# Altium schematic sheet Sheet1.SchDoc
size A3; DocumentNumber: 1; SheetNumber: 1; SheetTotal: 4
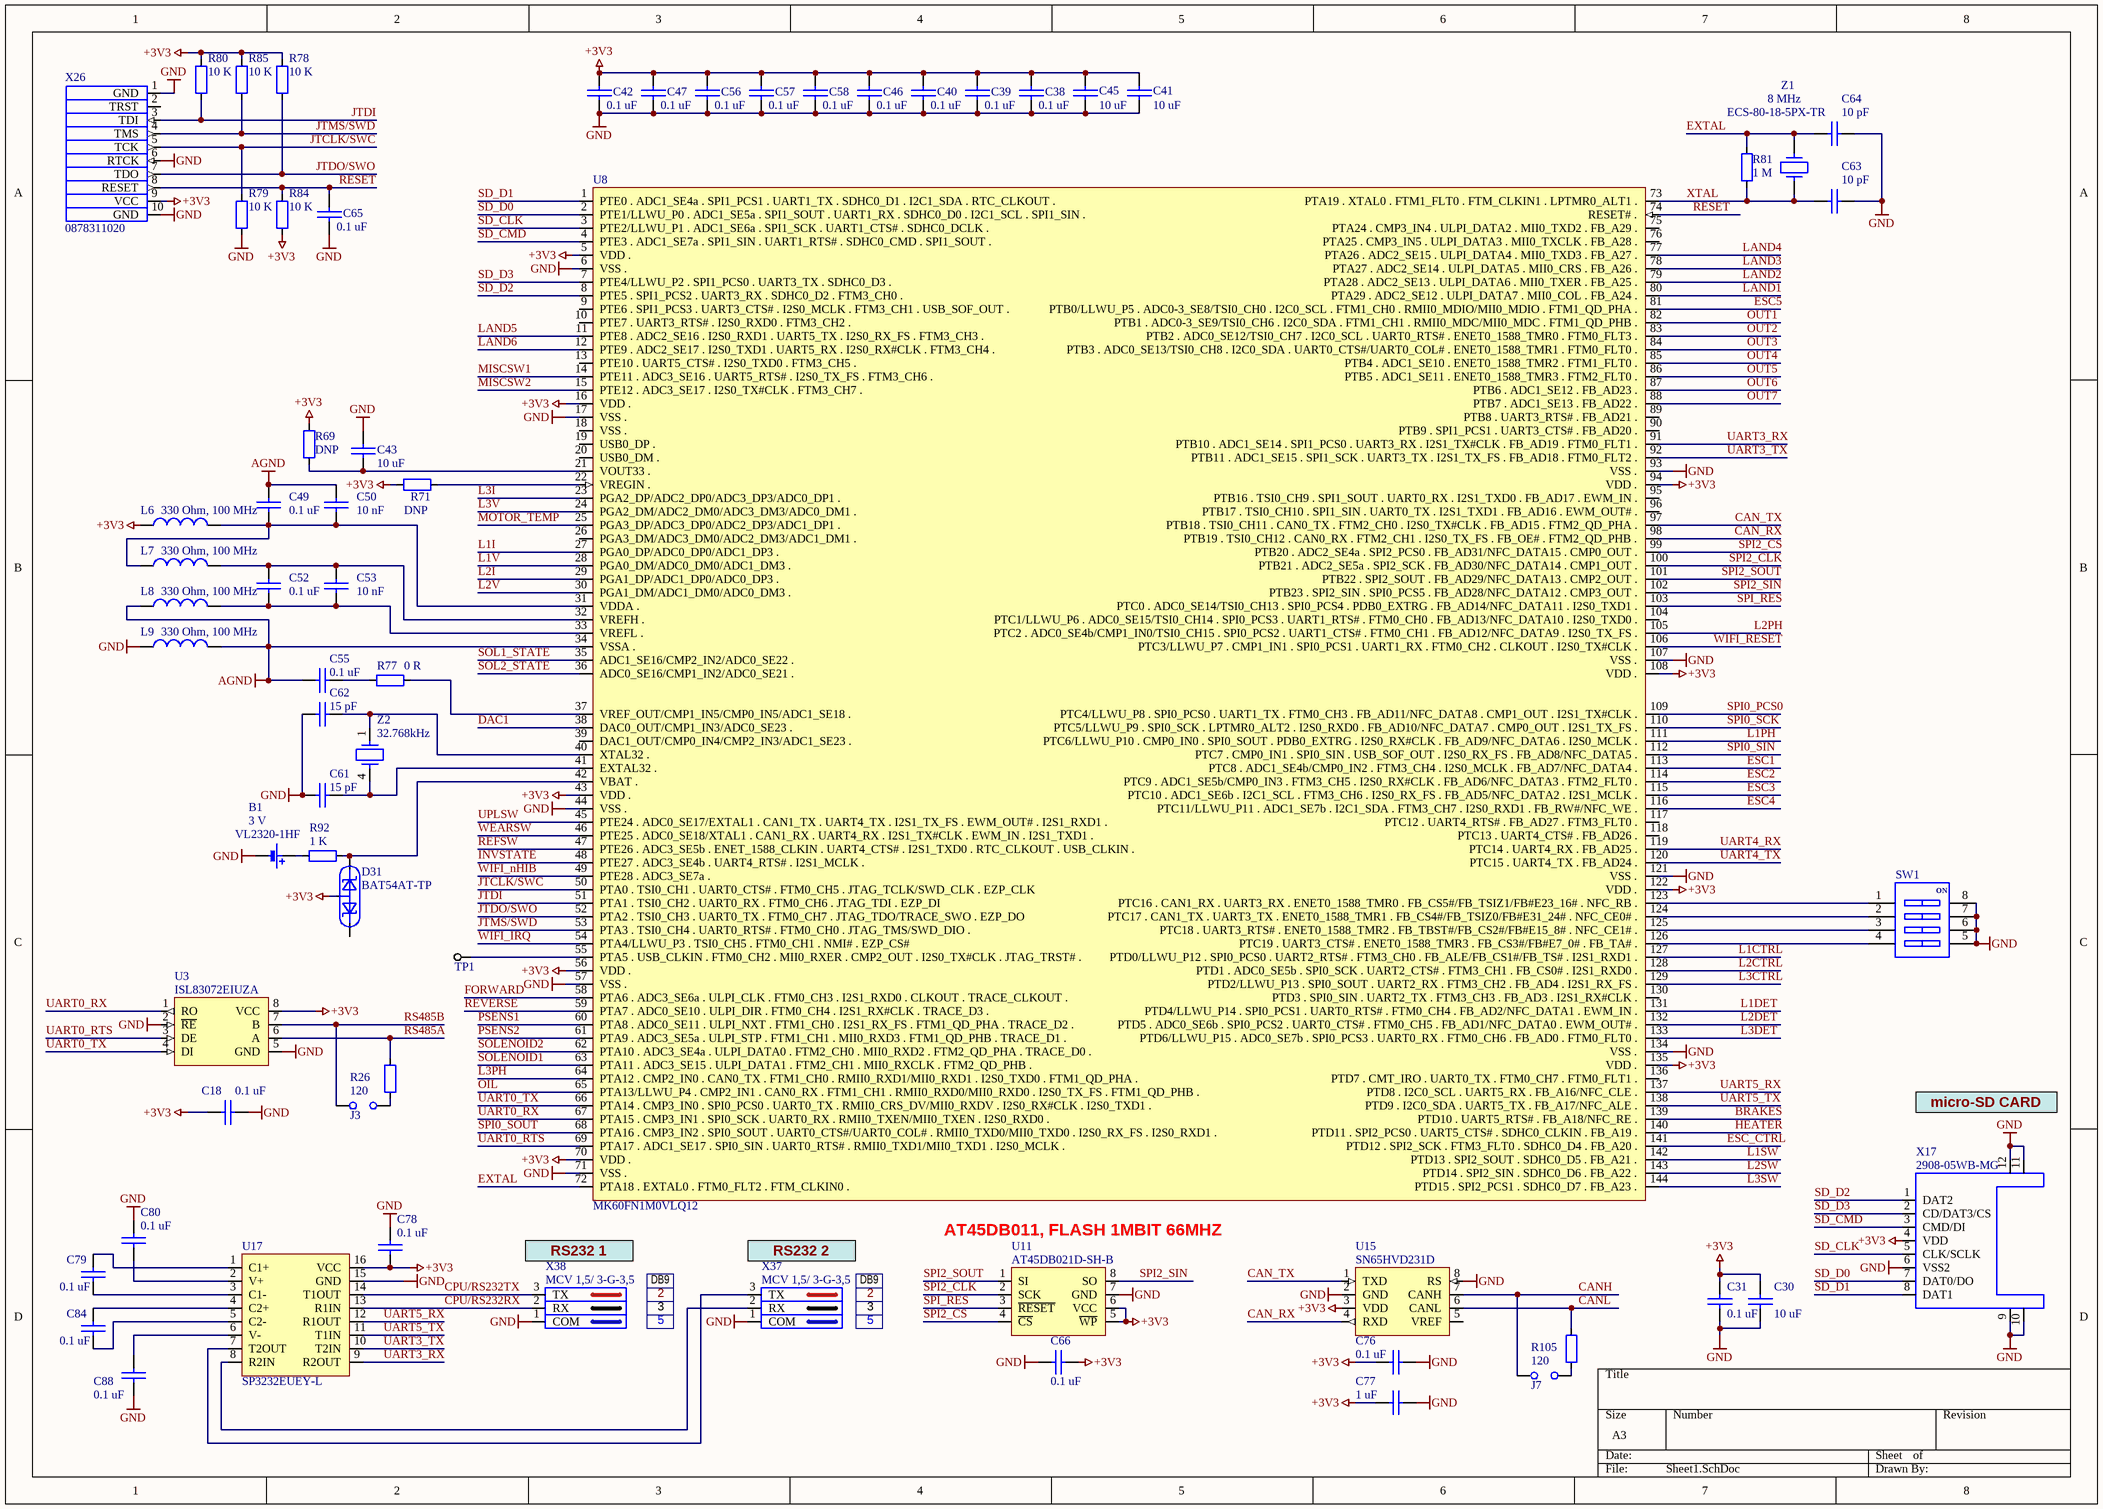
[diagram p0: Sheet1.SchDoc]

## Parts
B1  VL2320-1HF  value 3 V  [SANYO ML2430]
C18  value 0.1 uF  [1608[0603]]  (hidden comment: CVNF100K0603-25)
C30  value 10 uF  [2012[0805]]  (hidden comment: C2012X5R1C106K085AC)
C31  value 0.1 uF  [1608[0603]]  (hidden comment: CL10B104KA8NNND)
C38  value 0.1 uF  [1608[0603]]  (hidden comment: CL10B104KA8NNND)
C39  value 0.1 uF  [1608[0603]]  (hidden comment: CL10B104KA8NNND)
C40  value 0.1 uF  [1608[0603]]  (hidden comment: CL10B104KA8NNND)
C41  value 10 uF  [2012[0805]]  (hidden comment: C2012X5R1C106K085AC)
C42  value 0.1 uF  [1608[0603]]  (hidden comment: CL10B104KA8NNND)
C43  value 10 uF  [2012[0805]]  (hidden comment: C2012X5R1C106K085AC)
C45  value 10 uF  [2012[0805]]  (hidden comment: C2012X5R1C106K085AC)
C46  value 0.1 uF  [1608[0603]]  (hidden comment: CL10B104KA8NNND)
C47  value 0.1 uF  [1608[0603]]  (hidden comment: CL10B104KA8NNND)
C49  value 0.1 uF  [1608[0603]]  (hidden comment: CL10B104KA8NNND)
C50  value 10 nF  [1608[0603]]  (hidden comment: CL10B103JB8NNNC)
C52  value 0.1 uF  [1608[0603]]  (hidden comment: CL10B104KA8NNND)
C53  value 10 nF  [1608[0603]]  (hidden comment: CL10B103JB8NNNC)
C55  value 0.1 uF  [1608[0603]]  (hidden comment: CL10B104KA8NNND)
C56  value 0.1 uF  [1608[0603]]  (hidden comment: CL10B104KA8NNND)
C57  value 0.1 uF  [1608[0603]]  (hidden comment: CL10B104KA8NNND)
C58  value 0.1 uF  [1608[0603]]  (hidden comment: CL10B104KA8NNND)
C61  value 15 pF  [1608[0603]]  (hidden comment: CC0603JRNPO9BN150)
C62  value 15 pF  [1608[0603]]  (hidden comment: CC0603JRNPO9BN150)
C63  value 10 pF  [1608[0603]]  (hidden comment: CCPF010K0603)
C64  value 10 pF  [1608[0603]]  (hidden comment: CCPF010K0603)
C65  value 0.1 uF  [1608[0603]]  (hidden comment: CL10B104KA8NNND)
C66  value 0.1 uF  [1608[0603]]  (hidden comment: CL10B104KA8NNND)
C76  value 0.1 uF  [1608[0603]]  (hidden comment: CVNF100K0603-25)
C77  value 1 uF  [1608[0603]]  (hidden comment: GRM188R60J105KA01D)
C78  value 0.1 uF  [1608[0603]]  (hidden comment: CVNF100K0603-25)
C79  value 0.1 uF  [1608[0603]]  (hidden comment: CVNF100K0603-25)
C80  value 0.1 uF  [1608[0603]]  (hidden comment: CVNF100K0603-25)
C84  value 0.1 uF  [1608[0603]]  (hidden comment: CVNF100K0603-25)
C88  value 0.1 uF  [1608[0603]]  (hidden comment: CVNF100K0603-25)
D31  BAT54AT-TP  [SOT-523F]
J3  PH1-02-TA-HT  [HDR1X2V]  (value not drawn)
J7  PH1-02-TA-HT  [HDR1X2V]  (value not drawn)
L6  value 330 Ohm, 100 MHz  [0603]  (hidden comment: BLM18SG331TN1D)
L7  value 330 Ohm, 100 MHz  [0603]  (hidden comment: BLM18SG331TN1D)
L8  value 330 Ohm, 100 MHz  [0603]  (hidden comment: BLM18SG331TN1D)
L9  value 330 Ohm, 100 MHz  [0603]  (hidden comment: BLM18SG331TN1D)
R26  value 120  [0603]  (hidden comment: RL0603E120-1)
R69  value DNP  [0603]  (hidden comment: DNP_0603)  (no BOM)
R71  value DNP  [0603]  (hidden comment: DNP_0603)  (no BOM)
R77  value 0 R  [0603]  (hidden comment: RC0603JR-070RL)
R78  value 10 K  [0603]  (hidden comment: RL0603K010-1)
R79  value 10 K  [0603]  (hidden comment: RL0603K010-1)
R80  value 10 K  [0603]  (hidden comment: RL0603K010-1)
R81  value 1 M  [0603]  (hidden comment: RC0603FR-071ML)
R84  value 10 K  [0603]  (hidden comment: RL0603K010-1)
R85  value 10 K  [0603]  (hidden comment: RL0603K010-1)
R92  value 1 K  [0603]  (hidden comment: RC0603FR-071KL)
R105  value 120  [0603]  (hidden comment: RL0603E120-1)
SW1  MCDHN-04F-T-V  [MCDHN-04F-T-V]  (value not drawn)
TP1  Test_point 0.7 мм  [Test point 0.7 мм]  (value not drawn)  (net tie, no BOM)
U3  ISL83072EIUZA  [MSOP 8]
U8  MK60FN1M0VLQ12  [LQFP144]
U11  AT45DB021D-SH-B  [SO-8  wide]
U15  SN65HVD231D  [SO-8]
U17  SP3232EUEY-L  [TSOP65P640-16AM]
X17  2908-05WB-MG  [2908-05WB-MG]
X26  0878311020  [878311020 MGRID WALL HDR SMD]
X37  MCV 1,5/ 3-G-3,5  [mcv1.5-3-g_3.5]
X38  MCV 1,5/ 3-G-3,5  [mcv1.5-3-g_3.5]
Z1  ECS-80-18-5PX-TR  value 8 MHz  [Quartz Crystal SMU4]
Z2  value 32.768kHz  [CM200S]  (hidden comment: CM200C32768DZBT)

## Nets
+3V3: C18.1 C30.1 C31.1 C38.2 C39.2 C40.2 C41.1 C42.2 C45.1 C46.2 C47.2 C56.2 C57.2 C58.2 C66.1 C76.1 C77.1 C78.1 D31.3 L6.1 R69.2 R71.1 R78.2 R80.2 R84.1 R85.2 U3.8(VCC) U8.5(VDD_.) U8.16(VDD_.) U8.43(VDD_.) U8.56(VDD_.) U8.70(VDD_.) U8.94(VDD_.) U8.108(VDD_.) U8.122(VDD_.) U8.135(VDD_.) U11.5(~{WP}) U11.6(VCC) U15.3(VDD) U17.16(VCC) X17.4(VDD) X26.9(VCC)
AGND: C49.2 C50.2 C55.2 L8.1 L9.2 U8.34(VSSA_.)
GND: B1.1 C18.2 C30.2 C31.2 C38.1 C39.1 C40.1 C41.2 C42.1 C43.2 C45.2 C46.1 C47.1 C56.1 C57.1 C58.1 C61.2 C62.2 C63.2 C64.2 C65.1 C66.2 C76.2 C77.2 C78.2 C80.1 C88.2 L9.1 R79.1 SW1.5 SW1.6 SW1.7 SW1.8 U3.2(~{RE}) U3.5(GND) U8.6(VSS_.) U8.17(VSS_.) U8.44(VSS_.) U8.57(VSS_.) U8.71(VSS_.) U8.93(VSS_.) U8.107(VSS_.) U8.121(VSS_.) U8.134(VSS_.) U11.7(GND) U15.2(GND) U15.8(RS) U17.15(GND) X17.6(VSS2) X17.9 X17.10(WP) X17.11(GND) X17.12(GND) X26.1(GND) X26.6(RTCK) X26.10(GND) X37.1(COM) X38.1(COM)
BRAKES: U8.139(PTD10_._UART5_RTS#_._FB_A18/NFC_RE_.)
CAN_RX: U8.98(PTB19_._TSI0_CH12_._CAN0_RX_._FTM2_CH1_._I2S0_TX_FS_._FB_OE#_._FTM2_QD_PHB_.) U15.4(RXD)
CAN_TX: U8.97(PTB18_._TSI0_CH11_._CAN0_TX_._FTM2_CH0_._I2S0_TX#CLK_._FB_AD15_._FTM2_QD_PHA_.) U15.1(TXD)
CANH: J7.1 U15.7(CANH)
CANL: R105.2 U15.6(CANL)
CPU/RS232RX: U17.13(R1IN) X38.2(RX)
CPU/RS232TX: U17.14(T1OUT) X38.3(TX)
DAC1: U8.38(DAC0_OUT/CMP1_IN3/ADC0_SE23_.)
ESC1: U8.113(PTC8_._ADC1_SE4b/CMP0_IN2_._FTM3_CH4_._I2S0_MCLK_._FB_AD7/NFC_DATA4_.)
ESC2: U8.114(PTC9_._ADC1_SE5b/CMP0_IN3_._FTM3_CH5_._I2S0_RX#CLK_._FB_AD6/NFC_DATA3_._FTM2_FLT0_.)
ESC3: U8.115(PTC10_._ADC1_SE6b_._I2C1_SCL_._FTM3_CH6_._I2S0_RX_FS_._FB_AD5/NFC_DATA2_._I2S1_MCLK_.)
ESC4: U8.116(PTC11/LLWU_P11_._ADC1_SE7b_._I2C1_SDA_._FTM3_CH7_._I2S0_RXD1_._FB_RW#/NFC_WE_.)
ESC5: U8.81(PTB0/LLWU_P5_._ADC0-3_SE8/TSI0_CH0_._I2C0_SCL_._FTM1_CH0_._RMII0_MDIO/MII0_MDIO_._FTM1_QD_PHA_.)
ESC_CTRL: U8.141(PTD12_._SPI2_SCK_._FTM3_FLT0_._SDHC0_D4_._FB_A20_.)
EXTAL: C64.1 R81.2 U8.72(PTA18_._EXTAL0_._FTM0_FLT2_._FTM_CLKIN0_.) Z1.2
FORWARD: U8.58(PTA6_._ADC3_SE6a_._ULPI_CLK_._FTM0_CH3_._I2S1_RXD0_._CLKOUT_._TRACE_CLKOUT_.)
HEATER: U8.140(PTD11_._SPI2_PCS0_._UART5_CTS#_._SDHC0_CLKIN_._FB_A19_.)
INVSTATE: U8.48(PTE27_._ADC3_SE4b_._UART4_RTS#_._I2S1_MCLK_.)
JTCLK/SWC: R79.2 U8.50(PTA0_._TSI0_CH1_._UART0_CTS#_._FTM0_CH5_._JTAG_TCLK/SWD_CLK_._EZP_CLK) X26.5(TCK)
JTDI: R80.1 U8.51(PTA1_._TSI0_CH2_._UART0_RX_._FTM0_CH6_._JTAG_TDI_._EZP_DI) X26.3(TDI)
JTDO/SWO: R78.1 U8.52(PTA2_._TSI0_CH3_._UART0_TX_._FTM0_CH7_._JTAG_TDO/TRACE_SWO_._EZP_DO) X26.7(TDO)
JTMS/SWD: R85.1 U8.53(PTA3_._TSI0_CH4_._UART0_RTS#_._FTM0_CH0_._JTAG_TMS/SWD_DIO_.) X26.4(TMS)
L1CTRL: U8.127(PTD0/LLWU_P12_._SPI0_PCS0_._UART2_RTS#_._FTM3_CH0_._FB_ALE/FB_CS1#/FB_TS#_._I2S1_RXD1_.)
L1DET: U8.131(PTD4/LLWU_P14_._SPI0_PCS1_._UART0_RTS#_._FTM0_CH4_._FB_AD2/NFC_DATA1_._EWM_IN_.)
L1I: U8.27(PGA0_DP/ADC0_DP0/ADC1_DP3_.)
L1PH: U8.111(PTC6/LLWU_P10_._CMP0_IN0_._SPI0_SOUT_._PDB0_EXTRG_._I2S0_RX#CLK_._FB_AD9/NFC_DATA6_._I2S0_MCLK_.)
L1SW: U8.142(PTD13_._SPI2_SOUT_._SDHC0_D5_._FB_A21_.)
L1V: U8.28(PGA0_DM/ADC0_DM0/ADC1_DM3_.)
L2CTRL: U8.128(PTD1_._ADC0_SE5b_._SPI0_SCK_._UART2_CTS#_._FTM3_CH1_._FB_CS0#_._I2S1_RXD0_.)
L2DET: U8.132(PTD5_._ADC0_SE6b_._SPI0_PCS2_._UART0_CTS#_._FTM0_CH5_._FB_AD1/NFC_DATA0_._EWM_OUT#_.)
L2I: U8.29(PGA1_DP/ADC1_DP0/ADC0_DP3_.)
L2PH: U8.105(PTC2_._ADC0_SE4b/CMP1_IN0/TSI0_CH15_._SPI0_PCS2_._UART1_CTS#_._FTM0_CH1_._FB_AD12/NFC_DATA9_._I2S0_TX_FS_.)
L2SW: U8.143(PTD14_._SPI2_SIN_._SDHC0_D6_._FB_A22_.)
L2V: U8.30(PGA1_DM/ADC1_DM0/ADC0_DM3_.)
L3CTRL: U8.129(PTD2/LLWU_P13_._SPI0_SOUT_._UART2_RX_._FTM3_CH2_._FB_AD4_._I2S1_RX_FS_.)
L3DET: U8.133(PTD6/LLWU_P15_._ADC0_SE7b_._SPI0_PCS3_._UART0_RX_._FTM0_CH6_._FB_AD0_._FTM0_FLT0_.)
L3I: U8.23(PGA2_DP/ADC2_DP0/ADC3_DP3/ADC0_DP1_.)
L3PH: U8.64(PTA12_._CMP2_IN0_._CAN0_TX_._FTM1_CH0_._RMII0_RXD1/MII0_RXD1_._I2S0_TXD0_._FTM1_QD_PHA_.)
L3SW: U8.144(PTD15_._SPI2_PCS1_._SDHC0_D7_._FB_A23_.)
L3V: U8.24(PGA2_DM/ADC2_DM0/ADC3_DM3/ADC0_DM1_.)
LAND1: U8.80(PTA29_._ADC2_SE12_._ULPI_DATA7_._MII0_COL_._FB_A24_.)
LAND2: U8.79(PTA28_._ADC2_SE13_._ULPI_DATA6_._MII0_TXER_._FB_A25_.)
LAND3: U8.78(PTA27_._ADC2_SE14_._ULPI_DATA5_._MII0_CRS_._FB_A26_.)
LAND4: U8.77(PTA26_._ADC2_SE15_._ULPI_DATA4_._MII0_TXD3_._FB_A27_.)
LAND5: U8.11(PTE8_._ADC2_SE16_._I2S0_RXD1_._UART5_TX_._I2S0_RX_FS_._FTM3_CH3_.)
LAND6: U8.12(PTE9_._ADC2_SE17_._I2S0_TXD1_._UART5_RX_._I2S0_RX#CLK_._FTM3_CH4_.)
MISCSW1: U8.14(PTE11_._ADC3_SE16_._UART5_RTS#_._I2S0_TX_FS_._FTM3_CH6_.)
MISCSW2: U8.15(PTE12_._ADC3_SE17_._I2S0_TX#CLK_._FTM3_CH7_.)
MOTOR_TEMP: U8.25(PGA3_DP/ADC3_DP0/ADC2_DP3/ADC1_DP1_.)
OIL: U8.65(PTA13/LLWU_P4_._CMP2_IN1_._CAN0_RX_._FTM1_CH1_._RMII0_RXD0/MII0_RXD0_._I2S0_TX_FS_._FTM1_QD_PHB_.)
OUT1: U8.82(PTB1_._ADC0-3_SE9/TSI0_CH6_._I2C0_SDA_._FTM1_CH1_._RMII0_MDC/MII0_MDC_._FTM1_QD_PHB_.)
OUT2: U8.83(PTB2_._ADC0_SE12/TSI0_CH7_._I2C0_SCL_._UART0_RTS#_._ENET0_1588_TMR0_._FTM0_FLT3_.)
OUT3: U8.84(PTB3_._ADC0_SE13/TSI0_CH8_._I2C0_SDA_._UART0_CTS#/UART0_COL#_._ENET0_1588_TMR1_._FTM0_FLT0_.)
OUT4: U8.85(PTB4_._ADC1_SE10_._ENET0_1588_TMR2_._FTM1_FLT0_.)
OUT5: U8.86(PTB5_._ADC1_SE11_._ENET0_1588_TMR3_._FTM2_FLT0_.)
OUT6: U8.87(PTB6_._ADC1_SE12_._FB_AD23_.)
OUT7: U8.88(PTB7_._ADC1_SE13_._FB_AD22_.)
PSENS1: U8.60(PTA8_._ADC0_SE11_._ULPI_NXT_._FTM1_CH0_._I2S1_RX_FS_._FTM1_QD_PHA_._TRACE_D2_.)
PSENS2: U8.61(PTA9_._ADC3_SE5a_._ULPI_STP_._FTM1_CH1_._MII0_RXD3_._FTM1_QD_PHB_._TRACE_D1_.)
REFSW: U8.47(PTE26_._ADC3_SE5b_._ENET_1588_CLKIN_._UART4_CTS#_._I2S1_TXD0_._RTC_CLKOUT_._USB_CLKIN_.)
RESET: C65.2 R84.2 U8.74(RESET#_.) X26.8(RESET)
REVERSE: U8.59(PTA7_._ADC0_SE10_._ULPI_DIR_._FTM0_CH4_._I2S1_RX#CLK_._TRACE_D3_.)
RS485A: R26.2 U3.6(A)
RS485B: J3.1 U3.7(B)
SD_CLK: U8.3(PTE2/LLWU_P1_._ADC1_SE6a_._SPI1_SCK_._UART1_CTS#_._SDHC0_DCLK_.) X17.5(CLK/SCLK)
SD_CMD: U8.4(PTE3_._ADC1_SE7a_._SPI1_SIN_._UART1_RTS#_._SDHC0_CMD_._SPI1_SOUT_.) X17.3(CMD/DI)
SD_D0: U8.2(PTE1/LLWU_P0_._ADC1_SE5a_._SPI1_SOUT_._UART1_RX_._SDHC0_D0_._I2C1_SCL_._SPI1_SIN_.) X17.7(DAT0/DO)
SD_D1: U8.1(PTE0_._ADC1_SE4a_._SPI1_PCS1_._UART1_TX_._SDHC0_D1_._I2C1_SDA_._RTC_CLKOUT_.) X17.8(DAT1)
SD_D2: U8.8(PTE5_._SPI1_PCS2_._UART3_RX_._SDHC0_D2_._FTM3_CH0_.) X17.1(DAT2)
SD_D3: U8.7(PTE4/LLWU_P2_._SPI1_PCS0_._UART3_TX_._SDHC0_D3_.) X17.2(CD/DAT3/CS)
SOL1_STATE: U8.35(ADC1_SE16/CMP2_IN2/ADC0_SE22_.)
SOL2_STATE: U8.36(ADC0_SE16/CMP1_IN2/ADC0_SE21_.)
SOLENOID1: U8.63(PTA11_._ADC3_SE15_._ULPI_DATA1_._FTM2_CH1_._MII0_RXCLK_._FTM2_QD_PHB_.)
SOLENOID2: U8.62(PTA10_._ADC3_SE4a_._ULPI_DATA0_._FTM2_CH0_._MII0_RXD2_._FTM2_QD_PHA_._TRACE_D0_.)
SPI0_PCS0: U8.109(PTC4/LLWU_P8_._SPI0_PCS0_._UART1_TX_._FTM0_CH3_._FB_AD11/NFC_DATA8_._CMP1_OUT_._I2S1_TX#CLK_.)
SPI0_SCK: U8.110(PTC5/LLWU_P9_._SPI0_SCK_._LPTMR0_ALT2_._I2S0_RXD0_._FB_AD10/NFC_DATA7_._CMP0_OUT_._I2S1_TX_FS_.)
SPI0_SIN: U8.112(PTC7_._CMP0_IN1_._SPI0_SIN_._USB_SOF_OUT_._I2S0_RX_FS_._FB_AD8/NFC_DATA5_.)
SPI0_SOUT: U8.68(PTA16_._CMP3_IN2_._SPI0_SOUT_._UART0_CTS#/UART0_COL#_._RMII0_TXD0/MII0_TXD0_._I2S0_RX_FS_._I2S0_RXD1_.)
SPI2_CLK: U8.100(PTB21_._ADC2_SE5a_._SPI2_SCK_._FB_AD30/NFC_DATA14_._CMP1_OUT_.) U11.2(SCK)
SPI2_CS: U8.99(PTB20_._ADC2_SE4a_._SPI2_PCS0_._FB_AD31/NFC_DATA15_._CMP0_OUT_.) U11.4(~{CS})
SPI2_SIN: U8.102(PTB23_._SPI2_SIN_._SPI0_PCS5_._FB_AD28/NFC_DATA12_._CMP3_OUT_.) U11.8(SO)
SPI2_SOUT: U8.101(PTB22_._SPI2_SOUT_._FB_AD29/NFC_DATA13_._CMP2_OUT_.) U11.1(SI)
SPI_RES: U8.103(PTC0_._ADC0_SE14/TSI0_CH13_._SPI0_PCS4_._PDB0_EXTRG_._FB_AD14/NFC_DATA11_._I2S0_TXD1_.) U11.3(~{RESET})
UART0_RTS: U3.3(DE) U8.69(PTA17_._ADC1_SE17_._SPI0_SIN_._UART0_RTS#_._RMII0_TXD1/MII0_TXD1_._I2S0_MCLK_.)
UART0_RX: U3.1(RO) U8.67(PTA15_._CMP3_IN1_._SPI0_SCK_._UART0_RX_._RMII0_TXEN/MII0_TXEN_._I2S0_RXD0_.)
UART0_TX: U3.4(DI) U8.66(PTA14_._CMP3_IN0_._SPI0_PCS0_._UART0_TX_._RMII0_CRS_DV/MII0_RXDV_._I2S0_RX#CLK_._I2S0_TXD1_.)
UART3_RX: U8.91(PTB10_._ADC1_SE14_._SPI1_PCS0_._UART3_RX_._I2S1_TX#CLK_._FB_AD19_._FTM0_FLT1_.) U17.9(R2OUT)
UART3_TX: U8.92(PTB11_._ADC1_SE15_._SPI1_SCK_._UART3_TX_._I2S1_TX_FS_._FB_AD18_._FTM0_FLT2_.) U17.10(T2IN)
UART4_RX: U8.119(PTC14_._UART4_RX_._FB_AD25_.)
UART4_TX: U8.120(PTC15_._UART4_TX_._FB_AD24_.)
UART5_RX: U8.137(PTD8_._I2C0_SCL_._UART5_RX_._FB_A16/NFC_CLE_.) U17.12(R1OUT)
UART5_TX: U8.138(PTD9_._I2C0_SDA_._UART5_TX_._FB_A17/NFC_ALE_.) U17.11(T1IN)
UPLSW: U8.45(PTE24_._ADC0_SE17/EXTAL1_._CAN1_TX_._UART4_TX_._I2S1_TX_FS_._EWM_OUT#_._I2S1_RXD1_.)
WEARSW: U8.46(PTE25_._ADC0_SE18/XTAL1_._CAN1_RX_._UART4_RX_._I2S1_TX#CLK_._EWM_IN_._I2S1_TXD1_.)
WIFI_IRQ: U8.54(PTA4/LLWU_P3_._TSI0_CH5_._FTM0_CH1_._NMI#_._EZP_CS#)
WIFI_nHIB: U8.49(PTE28_._ADC3_SE7a_.)
WIFI_RESET: U8.106(PTC3/LLWU_P7_._CMP1_IN1_._SPI0_PCS1_._UART1_RX_._FTM0_CH2_._CLKOUT_._I2S0_TX#CLK_.)
XTAL: C63.1 R81.1 U8.73(PTA19_._XTAL0_._FTM1_FLT0_._FTM_CLKIN1_._LPTMR0_ALT1_.) Z1.1
NetB1_2: B1.2 R92.2
NetC43_1: C43.1 R69.1 U8.21(VOUT33_.)
NetC49_1: C49.1 C50.1 L6.2 L7.1 U8.31(VDDA_.)
NetC52_1: C52.1 C53.1 L8.2 U8.33(VREFL_.)
NetC52_2: C52.2 C53.2 L7.2 U8.32(VREFH_.)
NetC55_1: C55.1 R77.1
NetC61_1: C61.1 U8.41(EXTAL32_.) Z2.4
NetC62_1: C62.1 U8.40(XTAL32_.) Z2.1
NetC79_1: C79.1 U17.1(C1+)
NetC79_2: C79.2 U17.3(C1-)
NetC80_2: C80.2 U17.2(V+)
NetC84_1: C84.1 U17.4(C2+)
NetC84_2: C84.2 U17.5(C2-)
NetC88_1: C88.1 U17.6(V-)
NetD31_2: D31.2 R92.1 U8.42(VBAT_.)
NetJ3_2: J3.2 R26.1
NetJ7_2: J7.2 R105.1
NetR71_2: R71.2 U8.22(VREGIN_.)
NetR77_2: R77.2 U8.37(VREF_OUT/CMP1_IN5/CMP0_IN5/ADC1_SE18_.)
NetSW1_1: SW1.1 U8.123(PTC16_._CAN1_RX_._UART3_RX_._ENET0_1588_TMR0_._FB_CS5#/FB_TSIZ1/FB#E23_16#_._NFC_RB_.)
NetSW1_2: SW1.2 U8.124(PTC17_._CAN1_TX_._UART3_TX_._ENET0_1588_TMR1_._FB_CS4#/FB_TSIZ0/FB#E31_24#_._NFC_CE0#_.)
NetSW1_3: SW1.3 U8.125(PTC18_._UART3_RTS#_._ENET0_1588_TMR2_._FB_TBST#/FB_CS2#/FB#E15_8#_._NFC_CE1#_.)
NetSW1_4: SW1.4 U8.126(PTC19_._UART3_CTS#_._ENET0_1588_TMR3_._FB_CS3#/FB#E7_0#_._FB_TA#_.)
NetTP1_1: TP1.1 U8.55(PTA5_._USB_CLKIN_._FTM0_CH2_._MII0_RXER_._CMP2_OUT_._I2S0_TX#CLK_._JTAG_TRST#_.)
NetU17_7: U17.7(T2OUT) X37.3(TX)
NetU17_8: U17.8(R2IN) X37.2(RX)

Not connected (* = marked no-connect by the designer): D31 1; U8 9(PTE6_._SPI1_PCS3_._UART3_CTS#_._I2S0_MCLK_._FTM3_CH1_._USB_SOF_OUT_.) 10(PTE7_._UART3_RTS#_._I2S0_RXD0_._FTM3_CH2_.) 13(PTE10_._UART5_CTS#_._I2S0_TXD0_._FTM3_CH5_.) 18(VSS_.) 19(USB0_DP_.) 20(USB0_DM_.) 26(PGA3_DM/ADC3_DM0/ADC2_DM3/ADC1_DM1_.) 39(DAC1_OUT/CMP0_IN4/CMP2_IN3/ADC1_SE23_.) 75(PTA24_._CMP3_IN4_._ULPI_DATA2_._MII0_TXD2_._FB_A29_.) 76(PTA25_._CMP3_IN5_._ULPI_DATA3_._MII0_TXCLK_._FB_A28_.) 89(PTB8_._UART3_RTS#_._FB_AD21_.) 90(PTB9_._SPI1_PCS1_._UART3_CTS#_._FB_AD20_.) 95(PTB16_._TSI0_CH9_._SPI1_SOUT_._UART0_RX_._I2S1_TXD0_._FB_AD17_._EWM_IN_.) 96(PTB17_._TSI0_CH10_._SPI1_SIN_._UART0_TX_._I2S1_TXD1_._FB_AD16_._EWM_OUT#_.) 104(PTC1/LLWU_P6_._ADC0_SE15/TSI0_CH14_._SPI0_PCS3_._UART1_RTS#_._FTM0_CH0_._FB_AD13/NFC_DATA10_._I2S0_TXD0_.) 117(PTC12_._UART4_RTS#_._FB_AD27_._FTM3_FLT0_.) 118(PTC13_._UART4_CTS#_._FB_AD26_.) 130(PTD3_._SPI0_SIN_._UART2_TX_._FTM3_CH3_._FB_AD3_._I2S1_RX#CLK_.) 136(PTD7_._CMT_IRO_._UART0_TX_._FTM0_CH7_._FTM0_FLT1_.); U15 5(VREF); X26 2(TRST)

## Notes on the sheet
- micro-SD CARD
- RS232 1
- RS232 2
- AT45DB011, FLASH 1MBIT 66MHZ
- DB9
- 2
- 3
- 5
- (in symbol MCDHN-04F-T-V) ON

## Library data of the parts
B1 = VL2320-1HF: Rechargeable Litium battery, Sanyo, 100 mAh, 3.1 V; PartNum: P083-ND; Manufacturer: Panasonic - BSG; Price: 5.85$; Distributor: Digi-Key; PartName: VL2320-1HF
C18 C76 C78-C80 C84 C88 = CVNF100K0603-25: 0.1 uF, 25V, 10% , X7R,  0603 SMD MLC Capacitor; Manufacturer: SAMSUNG; PartNum: CL10B104KA8NNND; Tolerance: 10%; Distributor: Future; Price: 0.0026 Euro; Voltage: 25 V; PartName: CL10B104KA8NNND
C30 C41 C43 C45 = C2012X5R1C106K/0.85: 10 uF, 16V, X5R, ±10%, 0805; Manufacturer: TDK Corporation; Distributor: Future; Price: 0.0347 Euro; Tolerance: ±10%; PartNum: C2012X5R1C106K085AC; Voltage: 16V; PartName: C2012X5R1C106K085AC
C31 C38-C40 C42 C46 C47 C49 C52 C55-C58 C65 C66 = CVNF100K0603-25: 0.1 uF, 25V, 10% , X7R,  0603 SMD MLC Capacitor; Manufacturer: SAMSUNG; Tolerance: 10%; Distributor: Future; Price: 0.0026 Euro; Voltage: 25 V; PartNum: CL10B104KA8NNND; PartName: CL10B104KA8NNND
C50 C53 = CVNF010K0603: 10 nF, 50V, 5%, X7R, 0603 SMD MLC Capacitor; Manufacturer: SAMSUNG; Tolerance: 5%; Distributor: Future; Price: 0.0045 Euro; PartNum: CL10B103JB8NNNC; Voltage: 50 V; PartName: CL10B103JB8NNNC
C61 C62 = CCPF015K0603: 15 pF, 50V, 5%, NP0, 0603 SMD MLC Capacitor; Manufacturer: YAGEO AMERICA CORPORATION; Tolerance: 5%; Price: 0.003$; Distributor: Future; PartNum: CC0603JRNPO9BN150; Voltage: 50 V; PartName: CC0603JRNPO9BN150
C63 C64 = CCPF010K0603: 10 pF, 50V, 5%, NP0, 0603 SMD MLC Capacitor; Manufacturer: Kemet; PartNum: 399-1049-1-ND; PartName: C0603C100J5GACTU; Tolerance: 5%; Price: 0.0075$; Distributor: Digi-Key; Voltage: 50 V
C77 = GRM188R60J105KA01D: 1.0 uF, 6.3V, 10%, X5R, 0603; Manufacturer: Murata Electronics North America; PartNum: 490-1550-1-ND; Tolerance: +-10%; Distributor: DigiKey; Price: 0.023$; Voltage: 6.3 V; PartName: GRM188R60J105KA01D
D31 = BAT54AT-TP: Schottky Diode, 30 V, 200 mA, common anode, SOT523; Manufacturer: Micro Commercial Co; PartNum: BAT54AT-TPDKR-ND; Distributor: Digi-Key; Price: 0.52$; PartName: BAT54AT-TP
J3 J7 = Jumper: 2 Pos. 2.54 mm Single Row Through Hole Straight Pin Header; Manufacturer: ADAM TECH; Distributor: Future; Price: 0.02 Euro; PartNum: PH1-02-TA-HT; PartName: PH1-02-TA-HT
L6-L9 = BLM18SG331TN1D: Ferrite bead, 330 Ohm, 100 MHz,  1.5 A, 0.07 Ohm; Manufacturer: Murata Electronics North America; Tolerance: 25%; Distributor: Future; Price: 0.03 Euro; PartNum: BLM18SG331TN1D; PartName: BLM18SG331TN1D
R26 R105 = RL0603E120-1: 120 R, 1%, 0603, SMD Resistor, Taped; Manufacturer: Vishay; Voltage: 75 V; Distributor: Schukat; Price: 0.002 Euro; Tolerance: 1%; PartNum: RL0603E120-1; PartName: RL0603E120-1
R69 R71 = DNP_0603: DNP, 0603; PartNum: DNP; PartName: DNP
R77 = RL0603E000: 0 R, 5%, 0603, SMD Resistor, Taped; Manufacturer: YAGEO AMERICA CORPORATION; Voltage: 75 V; Distributor: Future; Price: 0.0017$; Tolerance: 5%; PartNum: RC0603JR-070RL; PartName: RC0603JR-070RL
R78-R80 R84 R85 = RL0603K010-1: 10 K, 1%, 0603, SMD Resistor, Taped; Manufacturer: Vishay Dale; PartNum: 541-10KGCT-ND; PartName: CRCW060310K0JNEA; Voltage: 75 V; Distributor: Digi-Key; Price: 0.016$; Tolerance: 1%
R81 = RC0603FR-071ML: 1 M, 1%, 0603, SMD Resistor, Taped; Manufacturer: YAGEO AMERICA CORPORATION; Voltage: 75 V; Distributor: Future; Price: 0.002 Euro; Tolerance: 1%; PartNum: RC0603FR-071ML; PartName: RC0603FR-071ML
R92 = RL0603K001-1: 1 K, 1%, 0603, SMD Resistor, Taped; Manufacturer: YAGEO AMERICA CORPORATION; Voltage: 75 V; Distributor: Future; Price: 0.0017$; Tolerance: 1%; PartNum: RC0603FR-071KL; PartName: RC0603FR-071KL
SW1 = MCDHN-04F-T-V: SWITCH, DIP, SMD, 4 WAY, 1.27mm; Manufacturer: MULTICOMP; PartNum: 1605479; Distributor: Farnell; Price: 0.69 Euro; PartName: 1605479
U3 = ISL3178EIUZ: RS485/422 Transc. 3..3.6V  , -40..+85 C,10-MSOP; Manufacturer: Intersil; PartNum: ISL83072EIUZA-TCT-ND; Price: 1.83$; Distributor: Digi-Key; PartName: ISL83072EIUZA
U8 = MK60FN1M0VLQ12: MK60 Series 32 Bit 1 MB Flash 128 KB Ram 120 Mhz Microcontroller - LQFP-144; Manufacturer: Freescale; Distributor: Future; PartNum: MK60FN1M0VLQ12; Price: 8.45 Euro; PartName: MK60FN1M0VLQ12
U11 = AT45DB011D-SH-T: IC DATAFLASH 1MBIT 2.7 V ~ 3.6 V 8-SOIC; Manufacturer: Adesto Technologies; PartNum: 1265-1033-1-ND; Price: 0.8$; Distributor: Digi-Key; PartName: AT45DB021D-SH-B
U15 = SN65HVD231D: 3.3-V CAN TRANSCEIVERS SO-8; Manufacturer: Texas Instruments; PartNum: 296-12206-5-ND; Price: 4.2$; Distributor: Digi-Key; PartName: SN65HVD231D
U17 = SP3232EUEY-L: IC TXRX RS232 ESD TRUE, 1 Mbps, -40+85C, 16TSSOP; Manufacturer: Exar Corporation; PartNum: 1016-1510-5-ND; Distributor: Digi-Key; Price: 1.5$; PartName: SP3232EUEY-L
X17 = 2908-05WB-MG: microSD cadr holder; Manufacturer: Amphenol Commercial Products; PartNum: 101-00660-68-6-1-ND; PartName: 101-00660-68-6; Price: 1.97$; Distributor: Digi-Key
X26 = 0878321020: JTAG, CONN HEADER 10POS 2MM VERT SMD; Manufacturer: Molex Inc; PartNum: WM18639-ND; Distributor: Digi-Key; Price: 1.29$; PartName: 0878321020
X37 X38 = MCV1.5/3-G-3.5: Header, 8 A, 160 V, 3.5 mm pitch, 3 pos; Manufacturer: Phoenix Contact; PartNum: 1843619; Distributor: Phoenix Contact; Price: 0.32 Euro; PartName: MCV 1,5/ 3-G-3,5
Z1 = ECS-80-18-5PX-TR: 8 MHz, CSM-7 Case Series, SMD, Low Profile, Load Capacitance 18pF  ,Operating Temperature -10°C ~ 70°C; Manufacturer: ECS Inc.; PartNum: XC1271CT-ND; Distributor: Digi-Key; Price: 0.61$; PartName: ECS-80-18-5PX-TR
Z2 = MC306-32,768: Crystal 32.768 kHz ±20 ppm 6 pF -40 to +85 °C SMT Tuning Fork Crystal; Manufacturer: CITIZEN FINETECH MIYOTA; Tolerance: 20 ppm; PartNum: CM200C32768DZBT; Price: 0.1956 Euro; Distributor: Future; PartName: CM200C32768DZBT